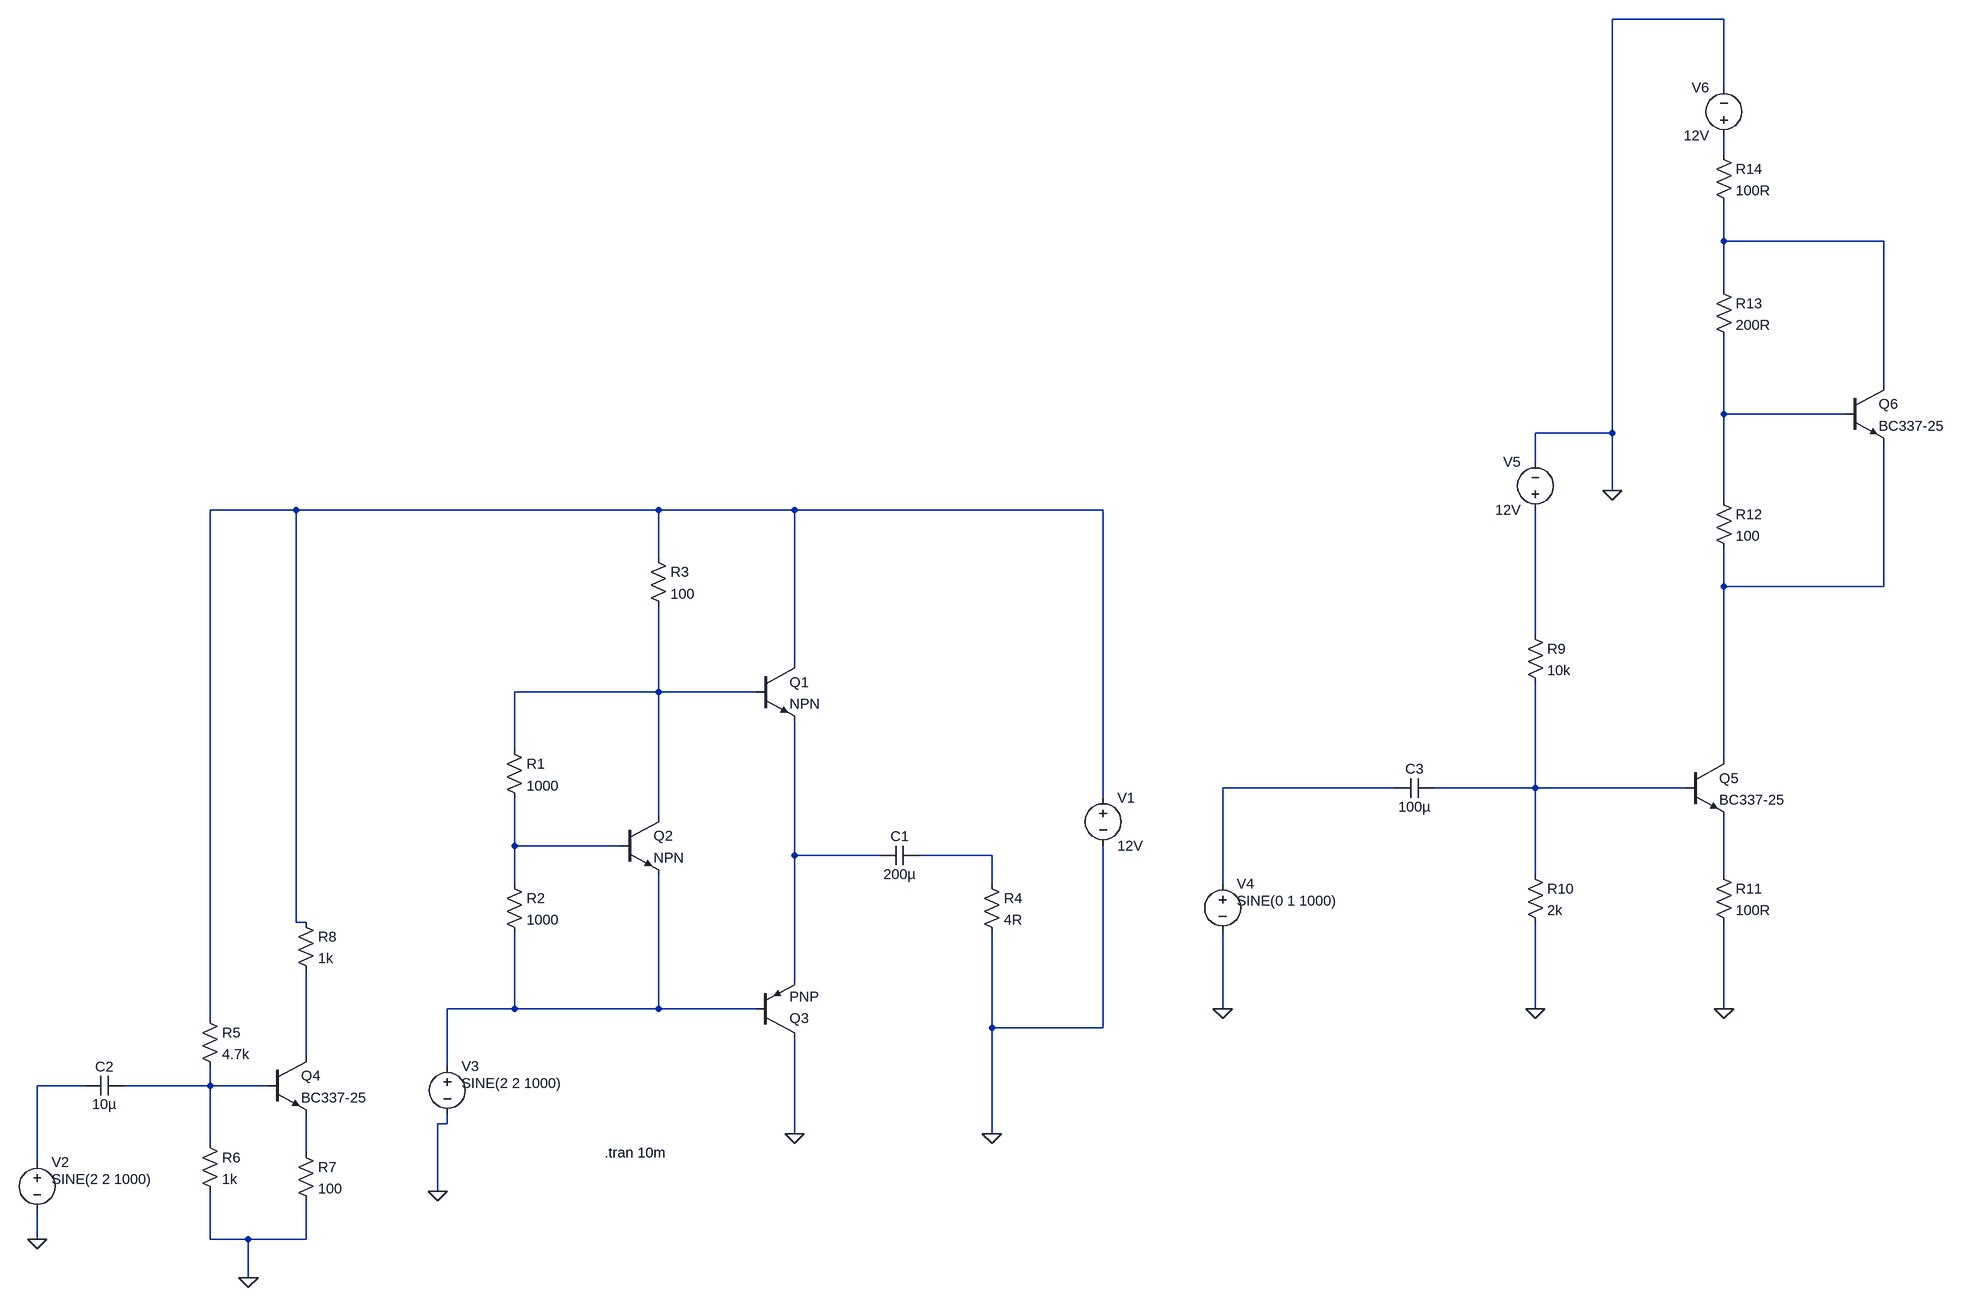
[diagram p0: schematic Draft1.asc]
Draft1.asc, the LTspice schematic file:
Version 4
SHEET 1 3520 1172
WIRE 3040 -976 2832 -976
WIRE 3040 -832 3040 -976
WIRE 3040 -720 3040 -752
WIRE 3040 -576 3040 -640
WIRE 3408 -576 3040 -576
WIRE 3040 -496 3040 -576
WIRE 3408 -336 3408 -576
WIRE 3040 -288 3040 -416
WIRE 3344 -288 3040 -288
WIRE 2832 -256 2832 -976
WIRE 2832 -256 2704 -256
WIRE 2704 -208 2704 -256
WIRE 2832 -160 2832 -256
WIRE 3040 -144 3040 -288
WIRE -800 -128 -944 -128
WIRE -128 -128 -800 -128
WIRE 192 -128 -128 -128
WIRE 960 -128 192 -128
WIRE -128 -48 -128 -128
WIRE 3040 0 3040 -64
WIRE 3408 0 3408 -240
WIRE 3408 0 3040 0
WIRE 2704 80 2704 -128
WIRE 192 128 192 -128
WIRE -128 176 -128 32
WIRE -128 176 -368 176
WIRE 128 176 -128 176
WIRE -368 272 -368 176
WIRE 3040 288 3040 0
WIRE 2304 336 2016 336
WIRE 2704 336 2704 160
WIRE 2704 336 2368 336
WIRE 2976 336 2704 336
WIRE 960 352 960 -128
WIRE -128 384 -128 176
WIRE -368 432 -368 352
WIRE -192 432 -368 432
WIRE 192 448 192 224
WIRE 352 448 192 448
WIRE 576 448 416 448
WIRE 2704 480 2704 336
WIRE 3040 480 3040 384
WIRE -368 496 -368 432
WIRE 576 496 576 448
WIRE 2016 496 2016 336
WIRE -800 560 -800 -128
WIRE -784 560 -800 560
WIRE 192 656 192 448
WIRE -368 704 -368 576
WIRE -368 704 -480 704
WIRE -128 704 -128 480
WIRE -128 704 -368 704
WIRE 128 704 -128 704
WIRE 2016 704 2016 576
WIRE 2704 704 2704 560
WIRE 3040 704 3040 560
WIRE -944 720 -944 -128
WIRE 576 736 576 576
WIRE 960 736 960 432
WIRE 960 736 576 736
WIRE -784 784 -784 640
WIRE -480 800 -480 704
WIRE -1152 832 -1232 832
WIRE -944 832 -944 800
WIRE -944 832 -1088 832
WIRE -848 832 -944 832
WIRE -480 896 -480 880
WIRE -480 896 -496 896
WIRE 192 912 192 752
WIRE 576 912 576 736
WIRE -944 928 -944 832
WIRE -784 944 -784 880
WIRE -1232 960 -1232 832
WIRE -496 1008 -496 896
WIRE -1232 1088 -1232 1040
WIRE -944 1088 -944 1008
WIRE -880 1088 -944 1088
WIRE -784 1088 -784 1024
WIRE -784 1088 -880 1088
WIRE -880 1152 -880 1088
FLAG -1232 1088 0
FLAG 192 912 0
FLAG 576 912 0
FLAG -880 1152 0
FLAG -496 1008 0
FLAG 2016 704 0
FLAG 2704 704 0
FLAG 2832 -160 0
FLAG 3040 704 0
SYMBOL npn 128 128 R0
SYMATTR InstName Q1
SYMBOL npn -192 384 R0
SYMATTR InstName Q2
SYMBOL res -384 256 R0
SYMATTR InstName R1
SYMATTR Value 1000
SYMBOL res -384 480 R0
SYMATTR InstName R2
SYMATTR Value 1000
SYMBOL res -144 -64 R0
SYMATTR InstName R3
SYMATTR Value 100
SYMBOL res 560 480 R0
SYMATTR InstName R4
SYMATTR Value 4R
SYMBOL voltage 960 336 R0
WINDOW 123 0 0 Left 0
WINDOW 39 0 0 Left 0
SYMATTR InstName V1
SYMATTR Value 12V
SYMBOL voltage -1232 944 R0
WINDOW 3 24 44 Left 2
WINDOW 123 0 0 Left 0
WINDOW 39 0 0 Left 0
SYMATTR InstName V2
SYMATTR Value SINE(2 2 1000)
SYMBOL pnp 128 752 M180
SYMATTR InstName Q3
SYMBOL cap 416 432 R90
WINDOW 0 0 32 VBottom 2
WINDOW 3 32 32 VTop 2
SYMATTR InstName C1
SYMATTR Value 200µ
SYMBOL npn -848 784 R0
SYMATTR InstName Q4
SYMATTR Value BC337-25
SYMBOL res -960 704 R0
SYMATTR InstName R5
SYMATTR Value 4.7k
SYMBOL res -960 912 R0
SYMATTR InstName R6
SYMATTR Value 1k
SYMBOL res -800 928 R0
SYMATTR InstName R7
SYMATTR Value 100
SYMBOL cap -1088 816 R90
WINDOW 0 0 32 VBottom 2
WINDOW 3 32 32 VTop 2
SYMATTR InstName C2
SYMATTR Value 10µ
SYMBOL voltage -480 784 R0
WINDOW 3 24 44 Left 2
WINDOW 123 0 0 Left 0
WINDOW 39 0 0 Left 0
SYMATTR InstName V3
SYMATTR Value SINE(2 2 1000)
SYMBOL res -800 544 R0
SYMATTR InstName R8
SYMATTR Value 1k
SYMBOL voltage 2016 480 R0
WINDOW 3 24 44 Left 2
WINDOW 123 0 0 Left 0
WINDOW 39 0 0 Left 0
SYMATTR InstName V4
SYMATTR Value SINE(0 1 1000)
SYMBOL cap 2368 320 R90
WINDOW 0 0 32 VBottom 2
WINDOW 3 32 32 VTop 2
SYMATTR InstName C3
SYMATTR Value 100µ
SYMBOL res 2688 64 R0
SYMATTR InstName R9
SYMATTR Value 10k
SYMBOL res 2688 464 R0
SYMATTR InstName R10
SYMATTR Value 2k
SYMBOL voltage 2704 -112 R180
WINDOW 0 24 96 Left 2
WINDOW 3 24 16 Left 2
SYMATTR InstName V5
SYMATTR Value 12V
SYMBOL npn 2976 288 R0
SYMATTR InstName Q5
SYMATTR Value BC337-25
SYMBOL res 3024 464 R0
SYMATTR InstName R11
SYMATTR Value 100R
SYMBOL res 3024 -160 R0
SYMATTR InstName R12
SYMATTR Value 100
SYMBOL res 3024 -512 R0
SYMATTR InstName R13
SYMATTR Value 200R
SYMBOL npn 3344 -336 R0
SYMATTR InstName Q6
SYMATTR Value BC337-25
SYMBOL voltage 3040 -736 R180
WINDOW 0 24 96 Left 2
WINDOW 3 24 16 Left 2
SYMATTR InstName V6
SYMATTR Value 12V
SYMBOL res 3024 -736 R0
SYMATTR InstName R14
SYMATTR Value 100R
TEXT -218 944 Left 2 !.tran 10m

The netlist it stands for:
* Draft1.asc
Q1 N004 N007 N011 0 NPN
Q2 N007 N010 N014 0 NPN
R1 N007 N010 1000
R2 N010 N014 1000
R3 N004 N007 100
R4 N012 0 4R
V1 N004 0 12V
V2 N016 0 SINE(2 2 1000)
Q3 0 N014 N011 0 PNP
C1 N012 N011 200µ
Q4 N015 N017 N018 0 BC337-25
R5 N004 N017 4.7k
R6 N017 0 1k
R7 N018 0 100
C2 N017 N016 10µ
V3 N014 0 SINE(2 2 1000)
R8 N004 N015 1k
V4 N008 0 SINE(0 1 1000)
C3 N009 N008 100µ
R9 N006 N009 10k
R10 N009 0 2k
V5 N006 0 12V
Q5 N005 N009 N013 0 BC337-25
R11 N013 0 100R
R12 N003 N005 100
R13 N002 N003 200R
Q6 N002 N003 N005 0 BC337-25
V6 N001 0 12V
R14 N001 N002 100R
.model NPN NPN
.model PNP PNP
.lib standard.bjt
.tran 10m
.backanno
.end